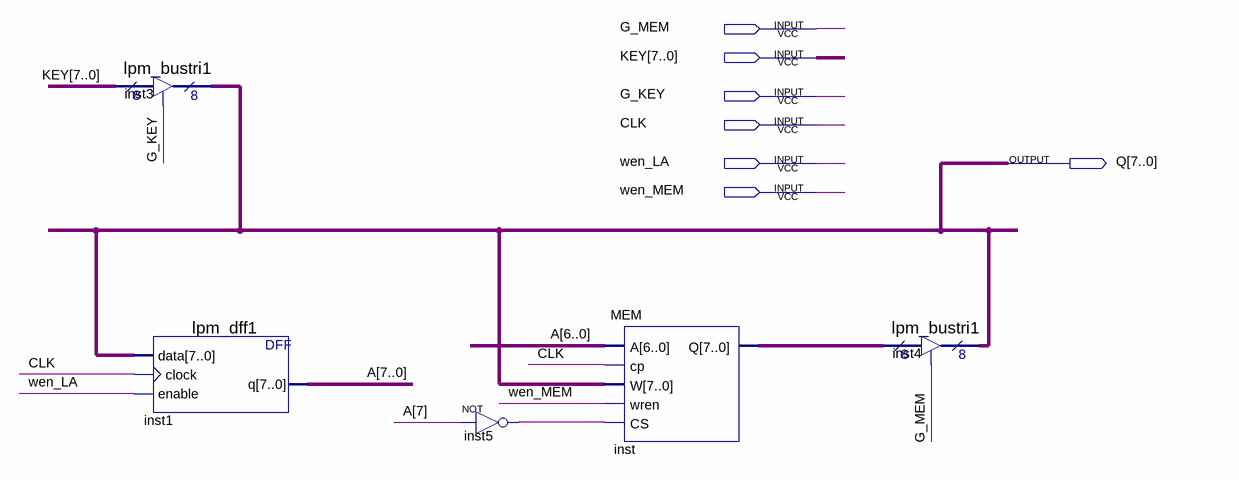
[diagram p0: schematic sheet]
// Quartus schematic BUS.bdf as structural Verilog: 5 symbols, 7 pins
module BUS (
  input  G_MEM,
  input  [7:0] KEY,
  input  G_KEY,
  input  CLK,
  input  wen_LA,
  input  wen_MEM,
  output [7:0] Q
);

  wire inst5_out;
  wire [7:0] A, inst_q;

  lpm_bustri1 inst3 (.enabledt(G_KEY), .data(KEY), .tridata(Q));
  lpm_dff1 inst1 (.data(Q), .clock(CLK), .enable(wen_LA), .q(A));
  not inst5 (inst5_out, A[7]);
  MEM inst (.A(A[6:0]), .cp(CLK), .W(Q), .wren(wen_MEM), .CS(inst5_out), .Q(inst_q));
  lpm_bustri1 inst4 (.enabledt(G_MEM), .data(inst_q), .tridata(Q));
endmodule
